# Altium schematic sheet Sheet2.SchDoc
size A4; SheetNumber: 2; SheetTotal: 2
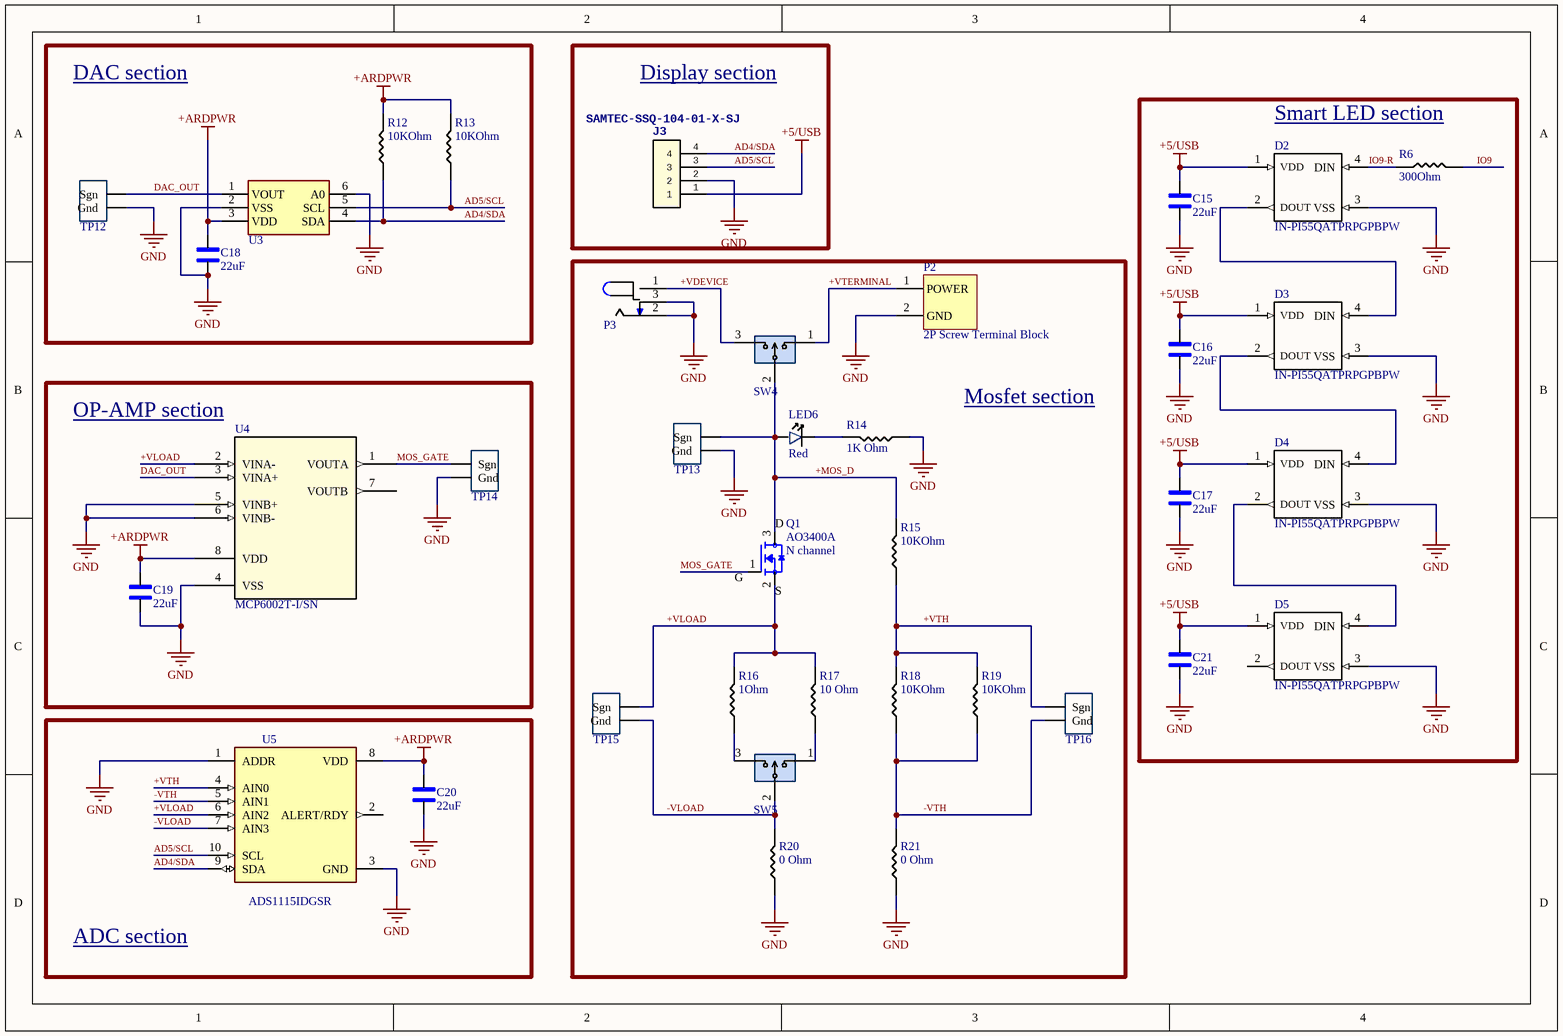
[diagram p0: Sheet2.SchDoc]

## Parts
C15  22uF  [1206_Passive_Capacitor]
C16  22uF  [1206_Passive_Capacitor]
C17  22uF  [1206_Passive_Capacitor]
C18  22uF  [1206_Passive_Capacitor]
C19  22uF  [1206_Passive_Capacitor]
C20  22uF  [1206_Passive_Capacitor]
C21  22uF  [1206_Passive_Capacitor]
D2  IN-PI55QATPRPGPBPW  [SERIAL_LED - duplicate]
D3  IN-PI55QATPRPGPBPW  [SERIAL_LED - duplicate]
D4  IN-PI55QATPRPGPBPW  [SERIAL_LED - duplicate]
D5  IN-PI55QATPRPGPBPW  [SERIAL_LED - duplicate]
J3  SAMTEC-SSQ-104-01-X-SJ  [JF-4_SSQ-104-01-X-S]
LED6  Red  [LED_1206]
P2  2P Screw Terminal Block  [P_Terminal block 3.5mm-pitch]
P3  Power Jack  [Power_Jack]  (value not drawn)
Q1  AO3400A  value N channel  [N-MOSFET]
R6  value 300Ohm  [1206_Passive_Resitor]  (hidden comment: 300 Ohm)
R12  value 10KOhm  [1206_Passive_Resitor]  (hidden comment: 10k)
R13  value 10KOhm  [1206_Passive_Resitor]  (hidden comment: 10k)
R14  value 1K Ohm  [1206_Passive_Resitor]  (hidden comment: 1k)
R15  value 10KOhm  [1206_Passive_Resitor]  (hidden comment: 10k)
R16  value 1Ohm  [1206_Passive_Resitor]  (hidden comment: 1 Ohm)
R17  10 Ohm  [1206_Passive_Resitor]
R18  value 10KOhm  [1206_Passive_Resitor]  (hidden comment: 10k)
R19  value 10KOhm  [1206_Passive_Resitor]  (hidden comment: 10k)
R20  0 Ohm  [1206_Passive_Resitor]
R21  0 Ohm  [1206_Passive_Resitor]
SW4  PREC003SAAN-RC  [3_PIN_100mil]  (value not drawn)
SW5  PREC003SAAN-RC  [3_PIN_100mil]  (value not drawn)
TP12  10x Probe TP  [TP10x_Probe]  (value not drawn)
TP13  10x Probe TP  [TP10x_Probe]  (value not drawn)
TP14  10x Probe TP  [TP10x_Probe]  (value not drawn)
TP15  10x Probe TP  [TP10x_Probe]  (value not drawn)
TP16  10x Probe TP  [TP10x_Probe]  (value not drawn)
U3  DAC IC  [MCP4725]  (value not drawn)
U4  MCP6002T-I/SN  [SOIC127P600X175-8N]
U5  ADS1115IDGSR  [ADC_ADS1115IDGSR]

## Blocks framed on the sheet
DAC section: C18 R12 R13 TP12 U3
Display section: J3
Smart LED section: C15-C17 C21 D2-D5 R6
Mosfet section: LED6 P2 P3 Q1 R14-R21 SW4 SW5 TP13 TP15 TP16
OP-AMP section: C19 TP14 U4
ADC section: C20 U5

## Nets
+5/USB: C15.2 C16.2 C17.2 C21.2 D2.1(VDD) D3.1(VDD) D4.1(VDD) D5.1(VDD) J3.1
+ARDPWR: C18.2 C19.2 C20.2 R12.2 R13.2 U3.3(VDD) U4.8(VDD) U5.8(VDD)
GND: C15.1 C16.1 C17.1 C18.1 C19.1 C20.1 C21.1 D2.3(VSS) D3.3(VSS) D4.3(VSS) D5.3(VSS) J3.2 P2.2(GND) P3.2 P3.3 R14.1 R20.1 R21.1 TP12.2(Gnd) TP13.2(Gnd) TP14.2(Gnd) U3.2(VSS) U3.6(A0) U4.4(VSS) U4.5(VINB+) U4.6(VINB-) U5.1(ADDR) U5.3(GND)
+MOS_D: LED6.1 Q1.3(D) R15.2 SW4.2 TP13.1(Sgn)
+VDEVICE: P3.1 SW4.3
+VLOAD: Q1.2(S) R16.2 R17.2 TP15.1(Sgn) U4.2(VINA-) U5.6(AIN2)
+VTERMINAL: P2.1(POWER) SW4.1
+VTH: R15.1 R18.2 R19.2 TP16.1(Sgn) U5.4(AIN0)
-VLOAD: R20.2 SW5.2 TP15.2(Gnd) U5.7(AIN3)
-VTH: R18.1 R19.1 R21.2 TP16.2(Gnd) U5.5(AIN1)
AD4/SDA: J3.4 R12.1 U3.4(SDA) U5.9(SDA)
AD5/SCL: J3.3 R13.1 U3.5(SCL) U5.10(SCL)
DAC_OUT: TP12.1(Sgn) U3.1(VOUT) U4.3(VINA+)
IO9: R6.2
IO9-R: D2.4(DIN) R6.1
MOS_GATE: Q1.1(G) TP14.1(Sgn) U4.1(VOUTA)
NetD2_2: D2.2(DOUT) D3.4(DIN)
NetD3_2: D3.2(DOUT) D4.4(DIN)
NetD4_2: D4.2(DOUT) D5.4(DIN)
NetLED6_2: LED6.2 R14.2
NetR16_1: R16.1 SW5.3
NetR17_1: R17.1 SW5.1

Not connected (* = marked no-connect by the designer): D5 2(DOUT); U4 7(VOUTB); U5 2(ALERT/RDY)

## Library data of the parts
C15-C21 = C_22uF_1206: 22uF ±10% 25V X5R 1206 Multilayer Ceramic Capacitors MLCC - SMD/SMT RoHS; MFR Part #: CL31A226KAHNNNE; Type: basic; LCSC Part#: C12891; Datasheet: https://datasheet.lcsc.com/lcsc/1811031514_Samsung-Electro-Mechanics-CL31A226KAHNNNE_C12891.pdf; Value: 22uF
D2-D5 = LED_Smart: LIGHT EMITTING DIODES (LED) RGB 620~630NM RED, 520~530NM GREEN, 465~475NM BLUE 600MCD@16MARED,1200MCD@16MAGREEN,300MCD@16MABLUE TOP VIEW SMD-4 ROHS; MFR Part #: XL-5050RGBC-WS2812B; Manufacturer: XINGLIGHT; LCSC Part#: C2843785; DataSheet: https://datasheet.lcsc.com/lcsc/2301111130_XINGLIGHT-XL-5050RGBC-WS2812B_C2843785.pdf
J3 = JF_4_PIN_FEMALE: 2.54mm 3A bronze -40℃~+105℃ Straight 1x4P Top 4 1 Square Holes Straight,P=2.54mm  Female Headers ROHS; MFR PART #: SSQ-104-01-X-SJ; LCSC PART#: C2718488
LED6 = LED_RED_1206: Red 621~631nm 1206 Light Emitting Diodes (LED) RoHS; MFR Part #: 15-21/R6C-FQ1R1B/2T; Type: Extended; LCSC Part#: C93133; Datasheet: https://datasheet.lcsc.com/szlcsc/1811151241_Everlight-Elec-15-21-R6C-FQ1R1B-2T_C93133.pdf; Value: Red
P2 = P_Terminal block: Green Straight pin 3.5mm  pitch; P=3.5mm  Screw terminal ROHS; MFR Part #: KF350-3.5-2P; Manufacturer: Cixi Kefa Elec; LCSC Part#: C474892; DataSheet: https://datasheet.lcsc.com/lcsc/2001160007_Cixi-Kefa-Elec-KF350-3-5-2P_C474892.pdf
P3 = P_Power Jack: Power Barrel Connector Jack 2.10mm ID (0.083"), 5.50mm OD (0.217") Through Hole, Right Angle; MFR Part #: PJ-102A; Value: CONN PWR JACK 2X5.5MM SOLDER; Digikey Link: https://www.digikey.com/product-detail/en/PJ-102A/CP-102A-ND/275425/?itemSeq=304982367; LCSC Part#: C136744; Type: Extended
Q1 = Q_Nch_MOSFET: MOSFET N Trench 30V 5.7A 1.5V @ 250uA 26.5 m? @ 5.7A,10V SOT-23-3L RoHS; Type: Basic; LCSC Part#: C20917; Datasheet: https://datasheet.lcsc.com/szlcsc/Alpha-Omega-Semicon-AOS-AO3400A_C20917.pdf; MFR Part #: AO3400A
R6 = R_300Ohm_1206: CHIP RESISTOR - SURFACE MOUNT 300OHMS ±1% 1/4W 1206 ROHS; MFR Part #: 1206W4F3000T5E; Datasheet: https://datasheet.lcsc.com/szlcsc/Uniroyal-Elec-1206W4F3000T5E_C17887.pdf; LCSC Part#: C17887; Type: Basic
R12 R13 R15 R18 R19 = R_10KOhm_1206: 10 kOhms ±5% 0.25W, 1/4W Chip Resistor 1206 (3216 Metric) Automotive AEC-Q200 Thick Film; MFR Part #: RMCF1206FT10K0; Digikey Link: https://www.digikey.com/en/products/detail/stackpole-electronics-inc/RMCF1206FT10K0/1759669; LCSC Part#: C17902; Type: Basic
R14 = R_1K_1206: CHIP RESISTOR - SURFACE MOUNT 1KOHMS ±1% 1/4W 1206 ROHS; MFR Part #: RNCP1206FTD1K00CT; Digikey Link: https://www.digikey.com/product-detail/en/RNCP1206FTD1K00/RNCP1206FTD1K00CT-ND/2240675/?itemSeq=304982373; LCSC Part#: C4410; Type: Basic
R16 = R_1Ohm_1206: 1Ω ±5% 0.25W ±400ppm/℃ 1206 Chip Resistor - Surface Mount RoHS; MFR Part #: 1206W4J010JT5E; LCSC Part#: C1409; Datasheet: https://datasheet.lcsc.com/lcsc/1810301410_UNI-ROYAL-Uniroyal-Elec-1206W4J010JT5E_C1409.pdf; Type: Extended
R17 = R_10Ohm_1206: CHIP RESISTOR - SURFACE MOUNT 0.1OHMS ±1% 1/4W 1206 ROHS; MFR Part #: 1206W4F100JT5E; Datasheet: https://datasheet.lcsc.com/szlcsc/Uniroyal-Elec-1206W4F100JT5E_C17903.pdf; LCSC Part#: C17903; Type: Basic; Value: 10 Ohm
R20 R21 = R_0Ohm_1206: CHIP RESISTOR - SURFACE MOUNT 0OHMS ±1% 1/4W 1206 ROHS; MFR Part #: 1206W4F0000T5E; Datasheet: https://datasheet.lcsc.com/szlcsc/Uniroyal-Elec-1206W4F0000T5E_C17888.pdf; LCSC Part#: C17888; Type: Basic; Mouser link: https://www.mouser.com/ProductDetail/Royalohm/1206W4F0000T5E?qs=e8oIoAS2J1Thbopin%252BsagQ%3D%3D; Value: 0 Ohm
SW4 SW5 = SW_3Pin_100mil_Switch: Connector Header Through Hole 3 position 0.100" (2.54mm); Value: CONN HEADER VERT 3POS 2.54MM; Digikey Link: https://www.digikey.com/product-detail/en/PREC003SAAN-RC/S1012EC-03-ND/2774851/?itemSeq=304982371; MFR Part #: PREC003SAAN-RC; Type: Extended; LCSC Part#: C49257
TP12-TP16 = TP_10x_Probe: Test Point 300 mil centers
U3 = U_MCP4725A0T-E/CH: IC DAC 12BIT V-OUT SOT23-6; Datasheet: https://ww1.microchip.com/downloads/en/DeviceDoc/22039d.pdf; LCSC Part#: C144198; type: Extended; MFR Part #: MCP4725A0T-E/CH
U4 = U_MCP6002T-I/SN: 0.6 V/us 2 1MHz 1.8V ~ 6V 100μA General Purpose SOIC-8_150mil  Operational Amplifier ROHS; Mfr: Microchip; MFR Part #: MCP6002T-I/SN; DataSheet: https://ww1.microchip.com/downloads/en/DeviceDoc/MCP6001-1R-1U-2-4-1-MHz-Low-Power-Op-Amp-DS20001733L.pdf; LCSC Part#: C7377; Type: Basic
U5 = U_ADC_ADS1115IDGSR: 16-Bit ADC with Integrated MUX, PGA, Comparator, Oscillator, and Reference 10-VSSOP -40 to 125; MFR Part #: ADS1115IDGSR; Package: MSOP-10 Texas Instruments; LCSC Part#: C37593; SnapEDA_Link: https://www.snapeda.com/parts/ADS1115IDGSR/Texas%20Instruments/view-part/?ref=snap; Type: Extended; DigiKey link: https://www.digikey.com/product-detail/en/texas-instruments/ADS1115IDGSR/296-38849-1-ND/5142969?utm_source=snapeda&utm_medium=aggregator&utm_campaign=symbol; Value: *